# Altium schematic sheet Nucleo.SchDoc: MCU áramkör+ táp
size A4; ENG_APP_DATE: --/--/--; DSN_APP_DATE: --/--/--; CHK_APP_DATE: --/--/--; Author: Horváth Patrik; Organization: BME-AUT; DocumentNumber: 2; Revision: A29; SheetNumber: 2; SheetTotal: 4
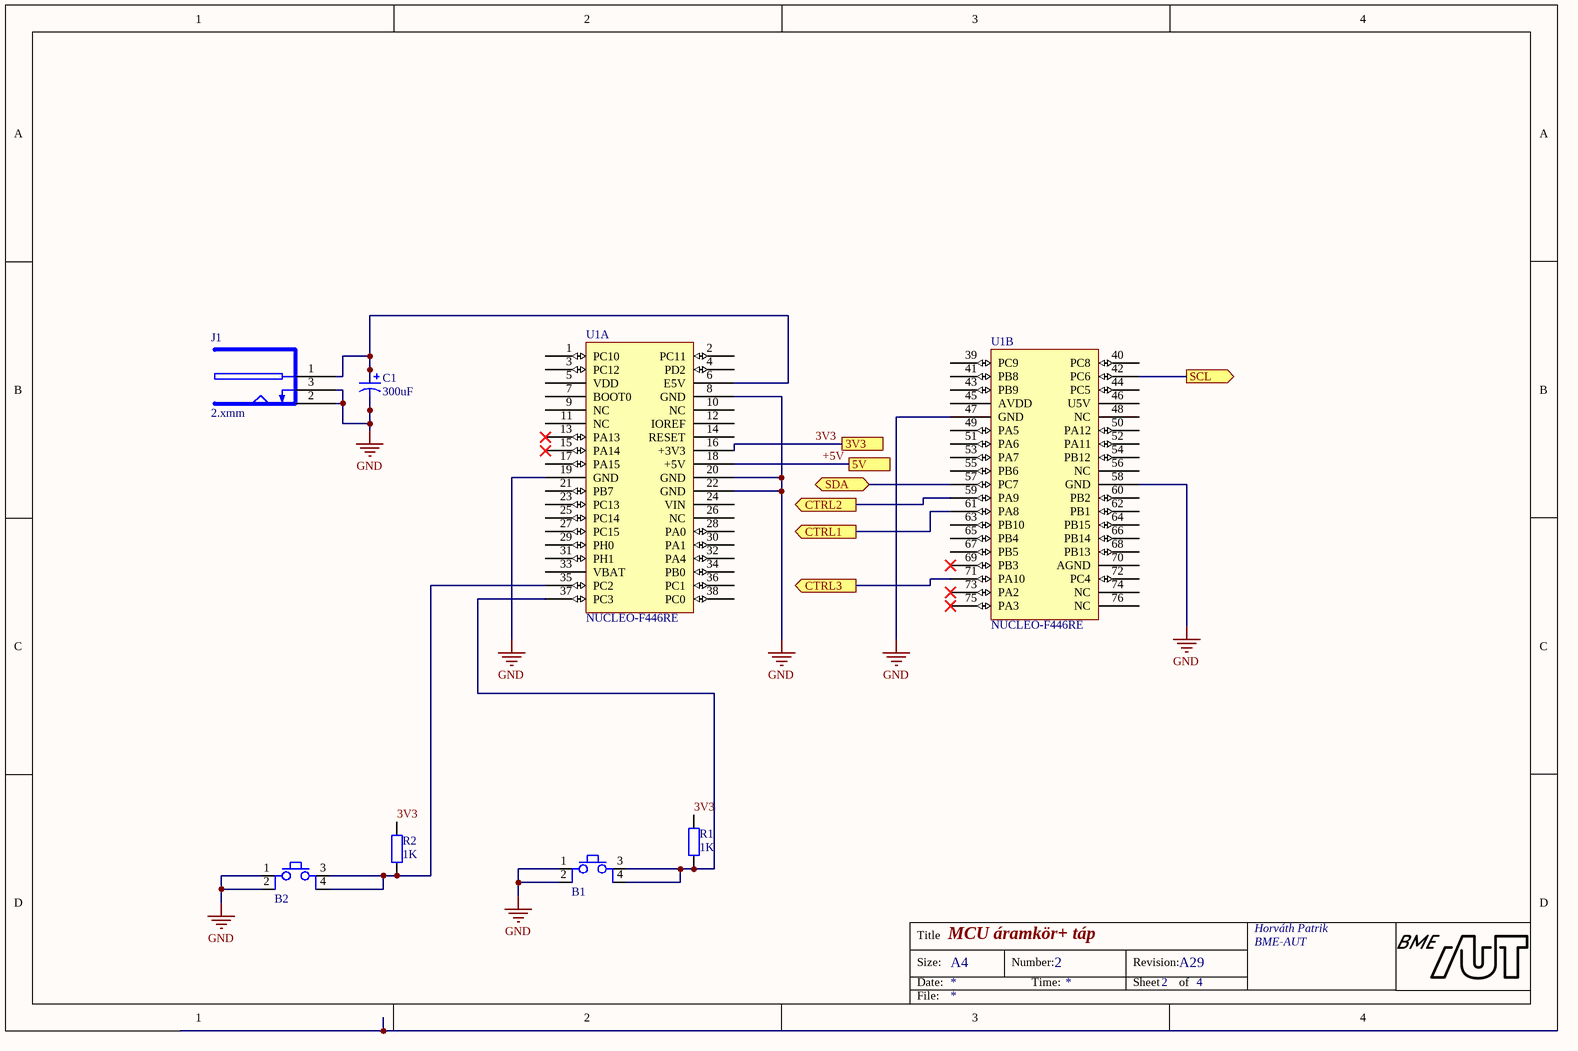
[diagram p0: Nucleo.SchDoc]

## Parts
B1  Button  [FP_BTN_SMD]  (value not drawn)
B2  Button  [FP_BTN_SMD]  (value not drawn)
C1  value 300uF  [CAP_AE_8x10]  (hidden comment: 100nF)
J1  2.xmm  [FP_DC_TAP_ANYA]
R1  1K  [FP_0805_RES]
R2  1K  [FP_0805_RES]
U1  NUCLEO-F446RE  [FP_NUCLEO-64]  (parts A,B of 2)

## Ports
3V3, 5V, CTRL1 (out), CTRL2 (out), CTRL3 (out), SCL (out), SDA (bidir)

## Nets
GND: B1.1 B1.2 B2.1 B2.2 C1.1 J1.2(SLEEVE) J1.3(BREAK) U1.8(GND) U1.19(GND) U1.20(GND) U1.22(GND) U1.47(GND) U1.58(GND)
3V3: R1.2 R2.2 U1.16(+3V3) ; port 3V3
+5V: U1.18(+5V) ; port 5V
CTRL1: U1.61(PA8) ; port CTRL1
CTRL2: U1.59(PA9) ; port CTRL2
CTRL3: U1.71(PA10) ; port CTRL3
SCL: U1.42(PC6) ; port SCL
SDA: U1.57(PC7) ; port SDA
NetB1_3: B1.3 B1.4 R1.1 U1.37(PC3)
NetB2_3: B2.3 B2.4 R2.1 U1.35(PC2)
NetC1_2: C1.2 J1.1(PIN) U1.6(E5V)

Not connected (* = marked no-connect by the designer): U1 1(PC10) 2(PC11) 3(PC12) 4(PD2) 5(VDD) 7(BOOT0) 9(NC) 10(NC) 11(NC) 12(IOREF) 13(PA13)* 14(RESET) 15(PA14)* 17(PA15) 21(PB7) 23(PC13) 24(VIN) 25(PC14) 26(NC) 27(PC15) 28(PA0) 29(PH0) 30(PA1) 31(PH1) 32(PA4) 33(VBAT) 34(PB0) 36(PC1) 38(PC0) 39(PC9) 40(PC8) 41(PB8) 43(PB9) 44(PC5) 45(AVDD) 46(U5V) 48(NC) 49(PA5) 50(PA12) 51(PA6) 52(PA11) 53(PA7) 54(PB12) 55(PB6) 56(NC) 60(PB2) 62(PB1) 63(PB10) 64(PB15) 65(PB4) 66(PB14) 67(PB5) 68(PB13) 69(PB3)* 70(AGND) 72(PC4) 73(PA2)* 74(NC) 75(PA3)* 76(NC)

## Notes on the sheet
- Title
- Size:
- Date:
- A4
- Number:
- Time:
- Revision:
- Sheet
- of
- File:

## Library data of the parts
B1 B2 = Button 4P: Push button; Name: FSM4JSMA; Reference: 45-05-43; Supplier: Lomex
C1 = CAP_ELECT: Polarized Capacitor; Name: 330uF 25V 8x10mm 20% 105° 8331LDM0810MZ0001T (FNG) LOW IMP.; Supplier: Lomex; Reference: 91-01-29
J1 = DC_TAP_ANYA: 2.xmm DC HEBA25 TÁPFESZÜLTSÉG ALJZAT ZÁRT, NYÁKBA 90°; Name: TÁP DC ANYA 5.5/2.1/9.5mm DCS-5521-5; Supplier: Lomex; Reference: 43-07-67
R1 R2 = RES: Resistor; Name: 1K00 0805 5% WR08X102JTL 0.125W (WAL); Supplier: Lomex; Reference: 81-27-93; Value: 1K
U1 = NUCLEO-F446RE: Reference: NUCLEO; Name: Nucleo F446RE; Supplier: Tanszék